# EasyEDA schematic SP501e.json

## Sheets
1 Sheet_1
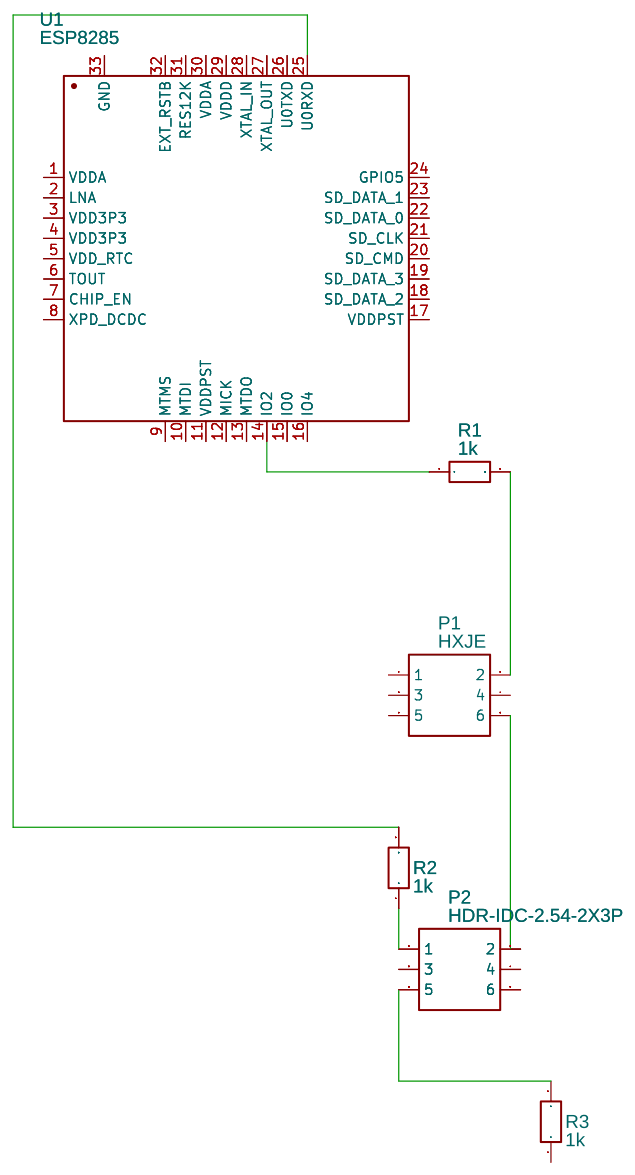
[diagram p0: Sheet_1]
2 Sheet_2: TITLE: Quick Start to EasyEDA; REV: 1.0; Date: 2018-03-29; Sheet: 2/2; Drawn By: EasyEDA
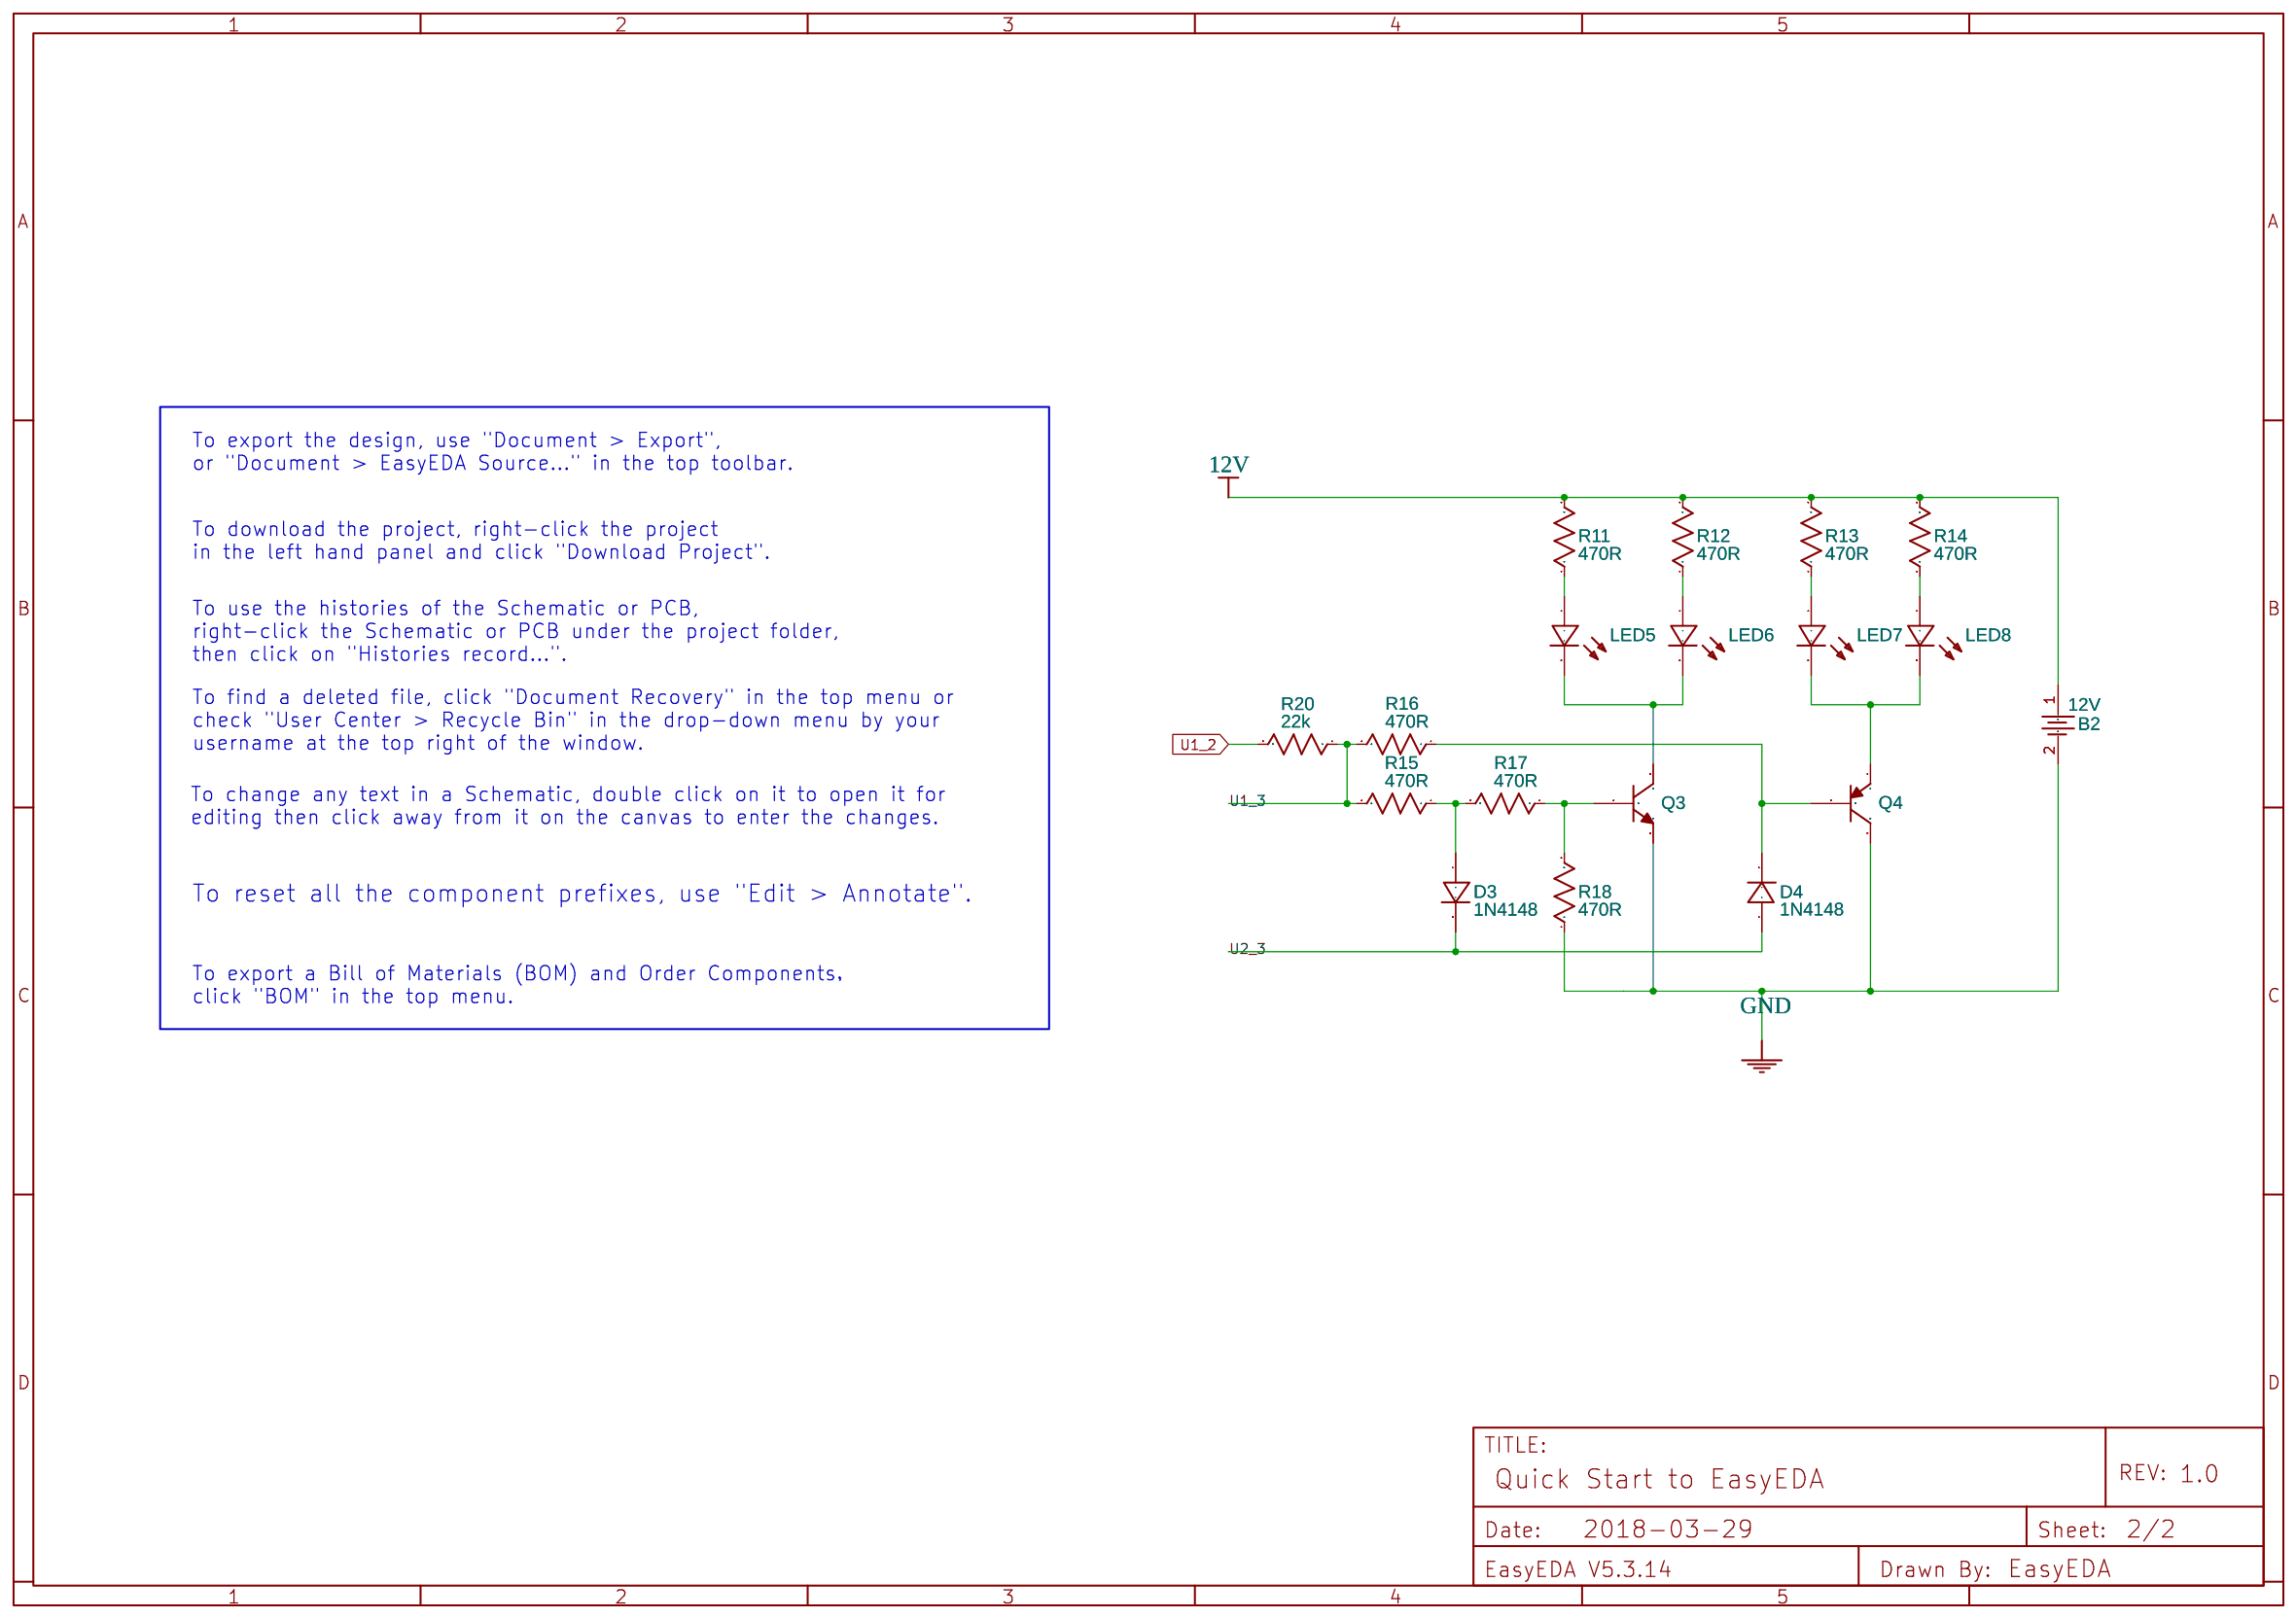
[diagram p1: Sheet_2]

## Parts
sheet Sheet_1
P1  HXJE  [HDR-IDC-2.54-2X3P]
P2  HDR-IDC-2.54-2X3P  [HDR-IDC-2.54-2X3P]
R1  1k  [AXIAL-0.3]
R2  1k  [AXIAL-0.3]
R3  1k  [AXIAL-0.3]
U1  ESP8285  [QFN-32_5X5X05P]
sheet Sheet_2
B2  12V  [BATTERY-1]
D3  1N4148  [DO35-10]
D4  1N4148  [DO35-10]
LED5  LED-Blue(0603)  [LED-0603]
LED6  LED-Blue(0603)  [LED-0603]
LED7  LED-Blue(0603)  [LED-0603]
LED8  LED-Blue(0603)  [LED-0603]
Q3  BC547B Tube  [TO-92(TO-92-3)]
Q4  2N3906  [TO-92(TO-92-3)]
R11  470R  [AXIAL-0.3]
R12  470R  [AXIAL-0.3]
R13  470R  [AXIAL-0.3]
R14  470R  [AXIAL-0.3]
R15  470R  [AXIAL-0.3]
R16  470R  [AXIAL-0.3]
R17  470R  [AXIAL-0.3]
R18  470R  [AXIAL-0.3]
R20  22k  [AXIAL-0.3]

## Library data of the parts
P1 P2 = HDR-IDC-2.54-2X3P: Supplier: LCSC; Manufacturer: BOOMELE; Manufacturer Part: 2X3 2.54mm IDC Box; image: //image.lceda.cn/szlcsc/C11214.jpg; Supplier Part: C11214
R1-R3 = Res_AXIAL-0.3(1/8W)_EU
U1 = ESP8285: Supplier: LCSC; Manufacturer: ESPRESSIF; image: //image.lceda.cn/szlcsc/C83901.jpg; Supplier Part: C83901; Contributor: epicface2304
B2 = -: Supplier: LCSC; Manufacturer: Q&J; Manufacturer Part: BS-2-1; image: http://image.lceda.cn/szlcsc/C70376.jpg; Supplier Part: C70376
D3 D4 = -: Manufacturer Part: ?
LED5-LED8 = -: Supplier: LCSC; Manufacturer: EVERLIGHT; Manufacturer Part: 19-217/BHC-ZL1M2RY/3T
Q3 Q4 = -: Supplier: LCSC; Manufacturer: CJ
R11-R18 = Res_AXIAL-0.3(1/8W)_US: Manufacturer Part: ?
R20 = Res_AXIAL-0.3(1/8W)_US: Manufacturer Part: ?; Mounted: Yes

## Nets
12V: B2.1 R11.2 R12.2 R13.2 R14.2
GND: B2.2 Q3.3(E) Q4.3(C) R18.1
U1_2: R20.2
U1_3: R15.2 R16.2 R20.1
U2_3: D3.2(-) D4.1(+)
Net-(D3-1): D3.1(+) R15.1 R17.2
Net-(D4-2): D4.2(-) Q4.2(B) R16.1
Net-(LED5-1): LED5.1(+) R11.1
Net-(LED5-2): LED5.2(-) LED6.2(-) Q3.1(C)
Net-(LED6-1): LED6.1(+) R12.1
Net-(LED7-1): LED7.1(+) R13.1
Net-(LED7-2): LED7.2(-) LED8.2(-) Q4.1(E)
Net-(LED8-1): LED8.1(+) R14.1
Net-(P1-2): P1.2 R1.2
Net-(P1-6): P1.6 P2.2
Net-(P2-1): P2.1 R2.1
Net-(P2-5): P2.5 R3.2
Net-(Q3-2): Q3.2(B) R17.1 R18.2
Net-(R1-1): R1.1 U1.14(IO2)
Net-(R2-2): R2.2 U1.25(U0RXD)

Not connected (* = marked no-connect by the designer): P1 1 3 4 5; P2 3 4 6; R3 1; U1 1(VDDA) 2(LNA) 3(VDD3P3) 4(VDD3P3) 5(VDD_RTC) 6(TOUT) 7(CHIP_EN) 8(XPD_DCDC) 9(MTMS) 10(MTDI) 11(VDDPST) 12(MICK) 13(MTDO) 15(IO0) 16(IO4) 17(VDDPST) 18(SD_DATA_2) 19(SD_DATA_3) 20(SD_CMD) 21(SD_CLK) 22(SD_DATA_0) 23(SD_DATA_1) 24(GPIO5) 26(U0TXD) 27(XTAL_OUT) 28(XTAL_IN) 29(VDDD) 30(VDDA) 31(RES12K) 32(EXT_RSTB) 33(GND)

## Notes on the sheets
sheet 2
- To export the design, use "Document > Export",
  or "Document > EasyEDA Source..." in the top toolbar.
- To download the project, right-click the project
  in the left hand panel and click "Download Project".
- To use the histories of the Schematic or PCB,
  right-click the Schematic or PCB under the project folder,
  then click on "Histories record...".
- To find a deleted file, click "Document Recovery" in the top menu or
  check "User Center > Recycle Bin" in the drop-down menu by your
  username at the top right of the window.
- To change any text in a Schematic, double click on it to open it for
  editing then click away from it on the canvas to enter the changes.
- To reset all the component prefixes, use "Edit > Annotate".
- To export a Bill of Materials (BOM) and Order Components，
  click "BOM" in the top menu.
